# EAGLE design H2BR00 (EAGLE 9.6.2)

## Sheet 1 of 2
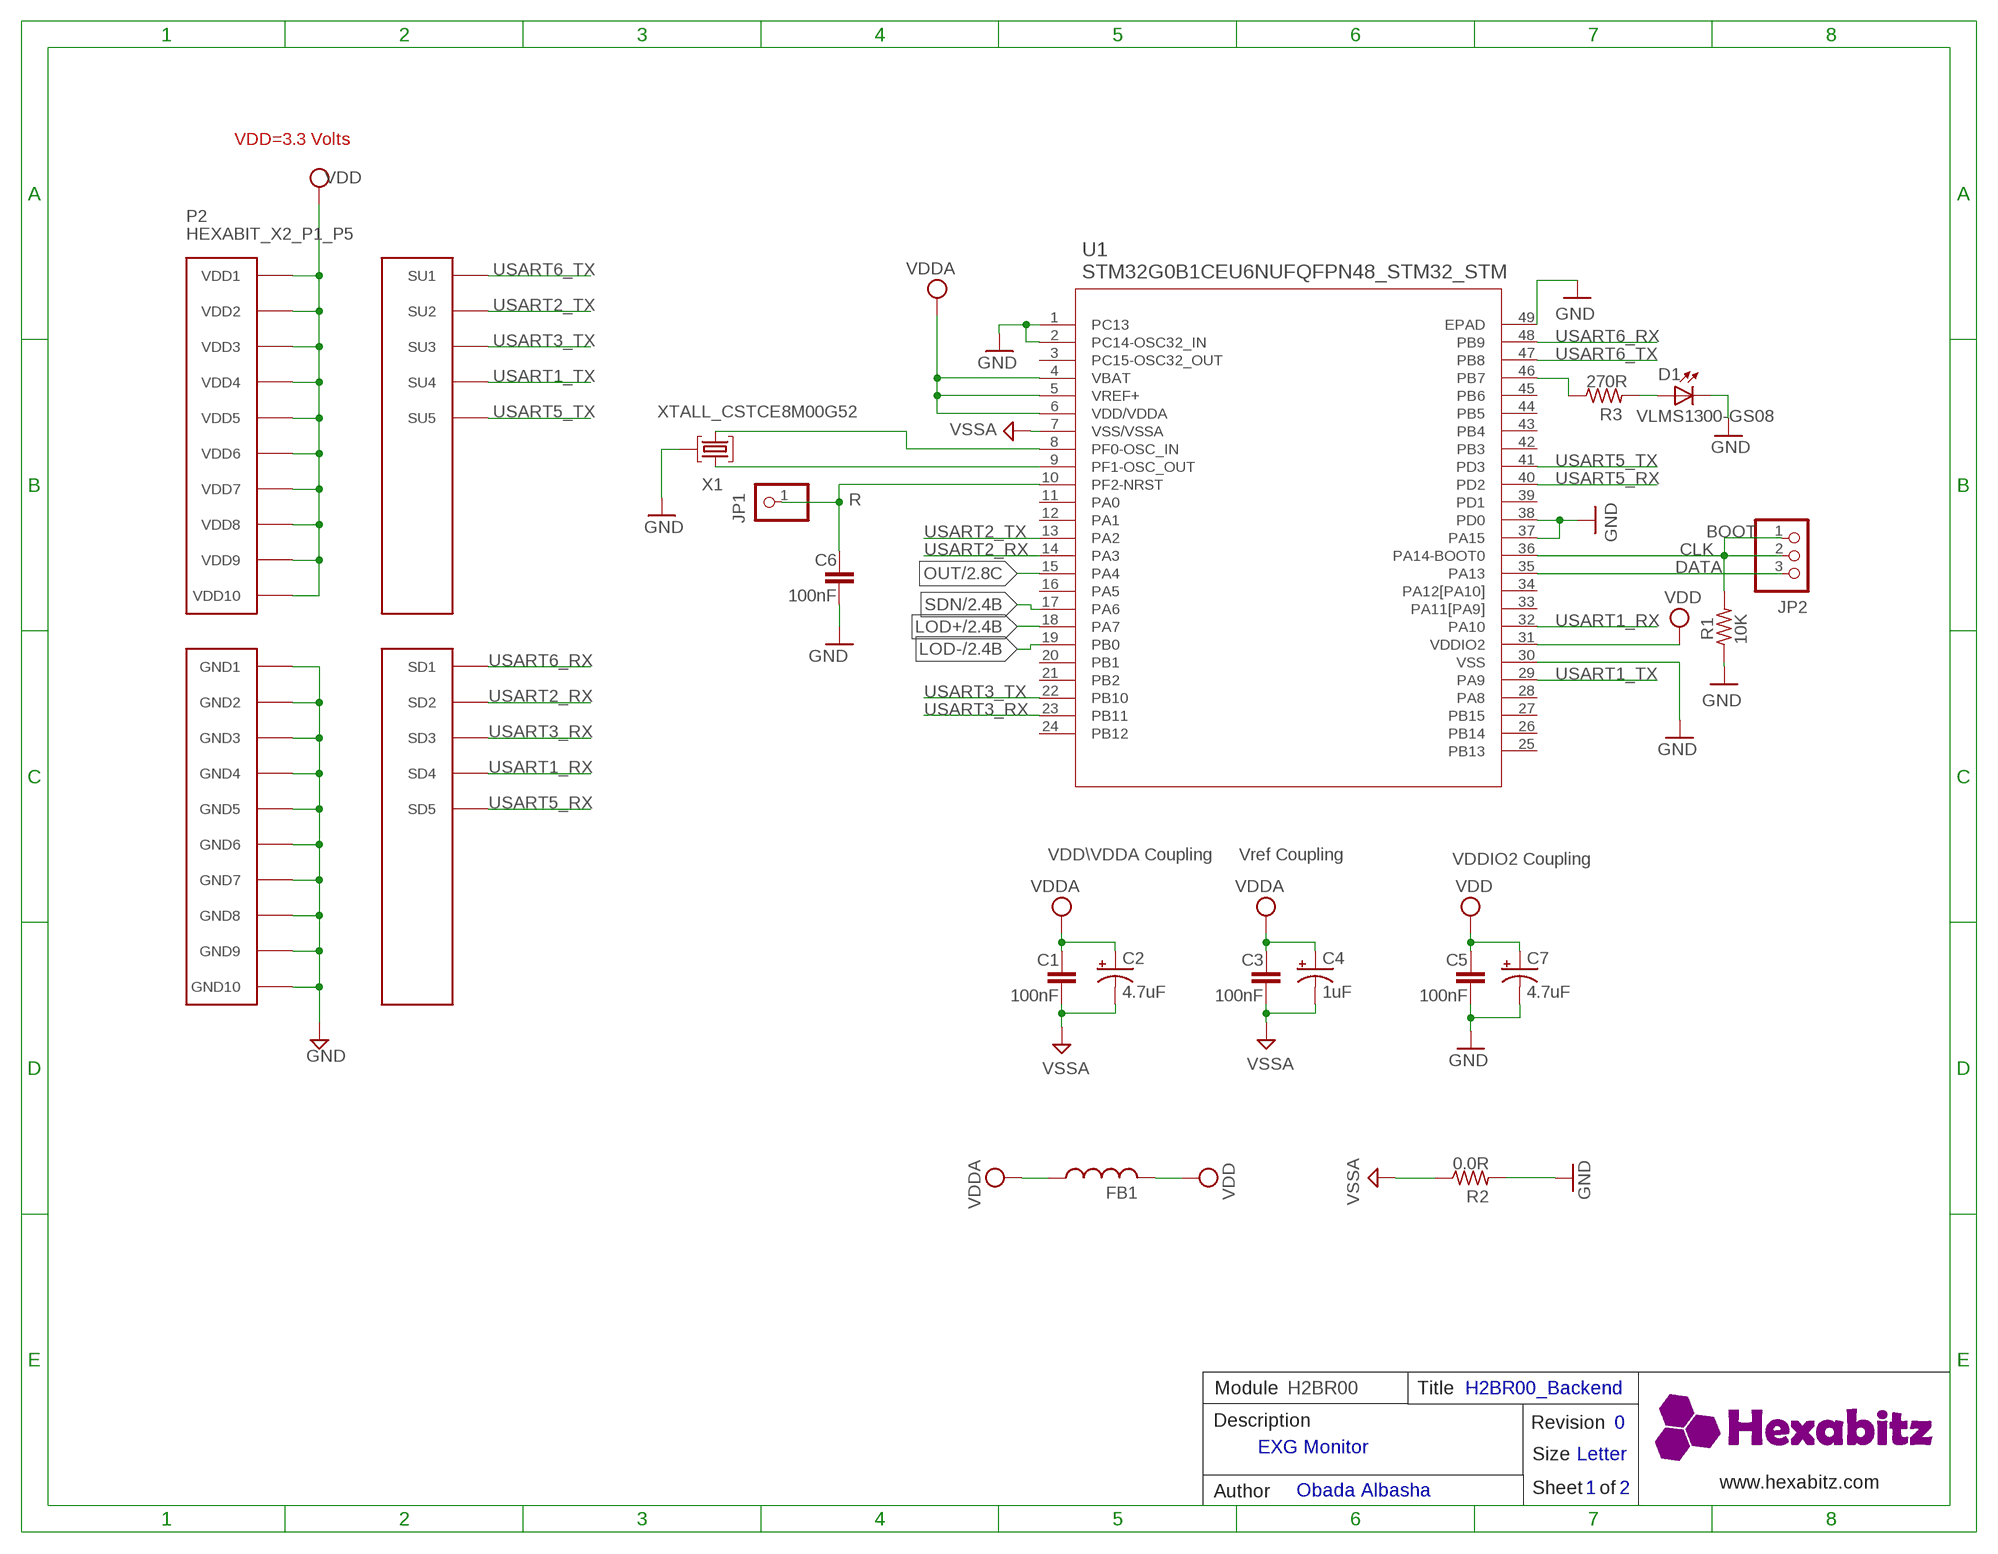
[diagram p0: schematic, sheet 1]

### Parts
C1  100nF  C-0603  [C-0603]
C2  4.7uF  C-0805-POL  [C-0805-POL]
C3  100nF  C-0603  [C-0603]
C4  1uF  C-0805-POL  [C-0805-POL]
C5  100nF  C-0603  [C-0603]
C6  100nF  C-0603  [C-0603]
C7  4.7uF  C-0805-POL  [C-0805-POL]
D1  VLMS1300-GS08  [VLMS1300-GS08]
FB1  FB-0603  [FB-0603]
JP1  R  PINHD-1X1  [1X01]
JP2  PINHD-1X3  [1X03]
P2  HEXABIT_X2_P1_P5  [HEXABIT_17.32_X2_P1_P5]
R1  10K  R-0603  [R-0603]
R2  0.0R  R-0603  [R-0603]
R3  270R  R-0603  [R-0603]
U1  STM32G0B1CEU6NUFQFPN48_STM32_STM  [UFQFPN48_STM32_STM]
X1  XTALL_CSTCE8M00G52  [XTALL_CSTCE8M00G52]

### Nets
CLK: JP2.1 JP2.2 R1.2 U1.36(PA14-BOOT0)
DATA: JP2.3 U1.35(PA13)
GND: C5.2 C6.2 C7.2(-) D1.C P2.PAD_PD11(GND1) P2.PAD_PD12(GND2) P2.PAD_PD13(GND3) P2.PAD_PD14(GND4) P2.PAD_PD15(GND5) P2.PAD_PD16(GND6) P2.PAD_PD17(GND7) P2.PAD_PD18(GND8) P2.PAD_PD19(GND9) P2.PAD_PD20(GND10) R1.1 R2.2 U1.1(PC13) U1.2(PC14-OSC32_IN) U1.30(VSS) U1.37(PA15) U1.38(PD0) U1.49(EPAD) X1.P$2 ; also sheet 2
LOD+: U1.18(PA7) ; also sheet 2
LOD-: U1.19(PB0) ; also sheet 2
N$1: D1.A R3.2
N$2: R3.1 U1.46(PB7)
N$5: U1.9(PF1-OSC_OUT) X1.P$1
N$6: U1.8(PF0-OSC_IN) X1.P$3
N$8: C6.1 JP1.1 U1.10(PF2-NRST)
OUT: U1.15(PA4) ; also sheet 2
SDN: U1.17(PA6) ; also sheet 2
USART1_RX: P2.PAD_PD4(SD4) U1.32(PA10)
USART1_TX: P2.PAD_PU4(SU4) U1.29(PA9)
USART2_RX: P2.PAD_PD2(SD2) U1.14(PA3)
USART2_TX: P2.PAD_PU2(SU2) U1.13(PA2)
USART3_RX: P2.PAD_PD3(SD3) U1.23(PB11)
USART3_TX: P2.PAD_PU3(SU3) U1.22(PB10)
USART5_RX: P2.PAD_PD5(SD5) U1.40(PD2)
USART5_TX: P2.PAD_PU5(SU5) U1.41(PD3)
USART6_RX: P2.PAD_PD1(SD1) U1.48(PB9)
USART6_TX: P2.PAD_PU1(SU1) U1.47(PB8)
VDD: C5.1 C7.1(+) FB1.2 P2.PAD_PU11(VDD1) P2.PAD_PU12(VDD2) P2.PAD_PU13(VDD3) P2.PAD_PU14(VDD4) P2.PAD_PU15(VDD5) P2.PAD_PU16(VDD6) P2.PAD_PU17(VDD7) P2.PAD_PU18(VDD8) P2.PAD_PU19(VDD9) P2.PAD_PU20(VDD10) U1.31(VDDIO2)
VDDA: C1.1 C2.1(+) C3.1 C4.1(+) FB1.1 U1.4(VBAT) U1.5(VREF+) U1.6(VDD/VDDA) ; also sheet 2
VSSA: C1.2 C2.2(-) C3.2 C4.2(-) R2.1 U1.7(VSS/VSSA)
Unconnected: U1.3(PC15-OSC32_OUT) U1.11(PA0) U1.12(PA1) U1.16(PA5) U1.20(PB1) U1.21(PB2) U1.24(PB12) U1.25(PB13) U1.26(PB14) U1.27(PB15) U1.28(PA8) U1.33(PA11[PA9]) U1.34(PA12[PA10]) U1.39(PD1) U1.42(PB3) U1.43(PB4) U1.44(PB5) U1.45(PB6)

### Notes on the sheet
- VDD=3.3 Volts
- BOOT
- VDD\VDDA Coupling | Vref Coupling | VDDIO2 Coupling
- Module | H2BR00 | Title | H2BR00_Backend
- Description | Revision | 0
- EXG Monitor
- Size | Letter
- www.hexabitz.com
- Author | Obada Albasha | Sheet   of | 1 | 2
- C:/Users/Admin/Desktop/logodraft.bmp

## Sheet 2 of 2
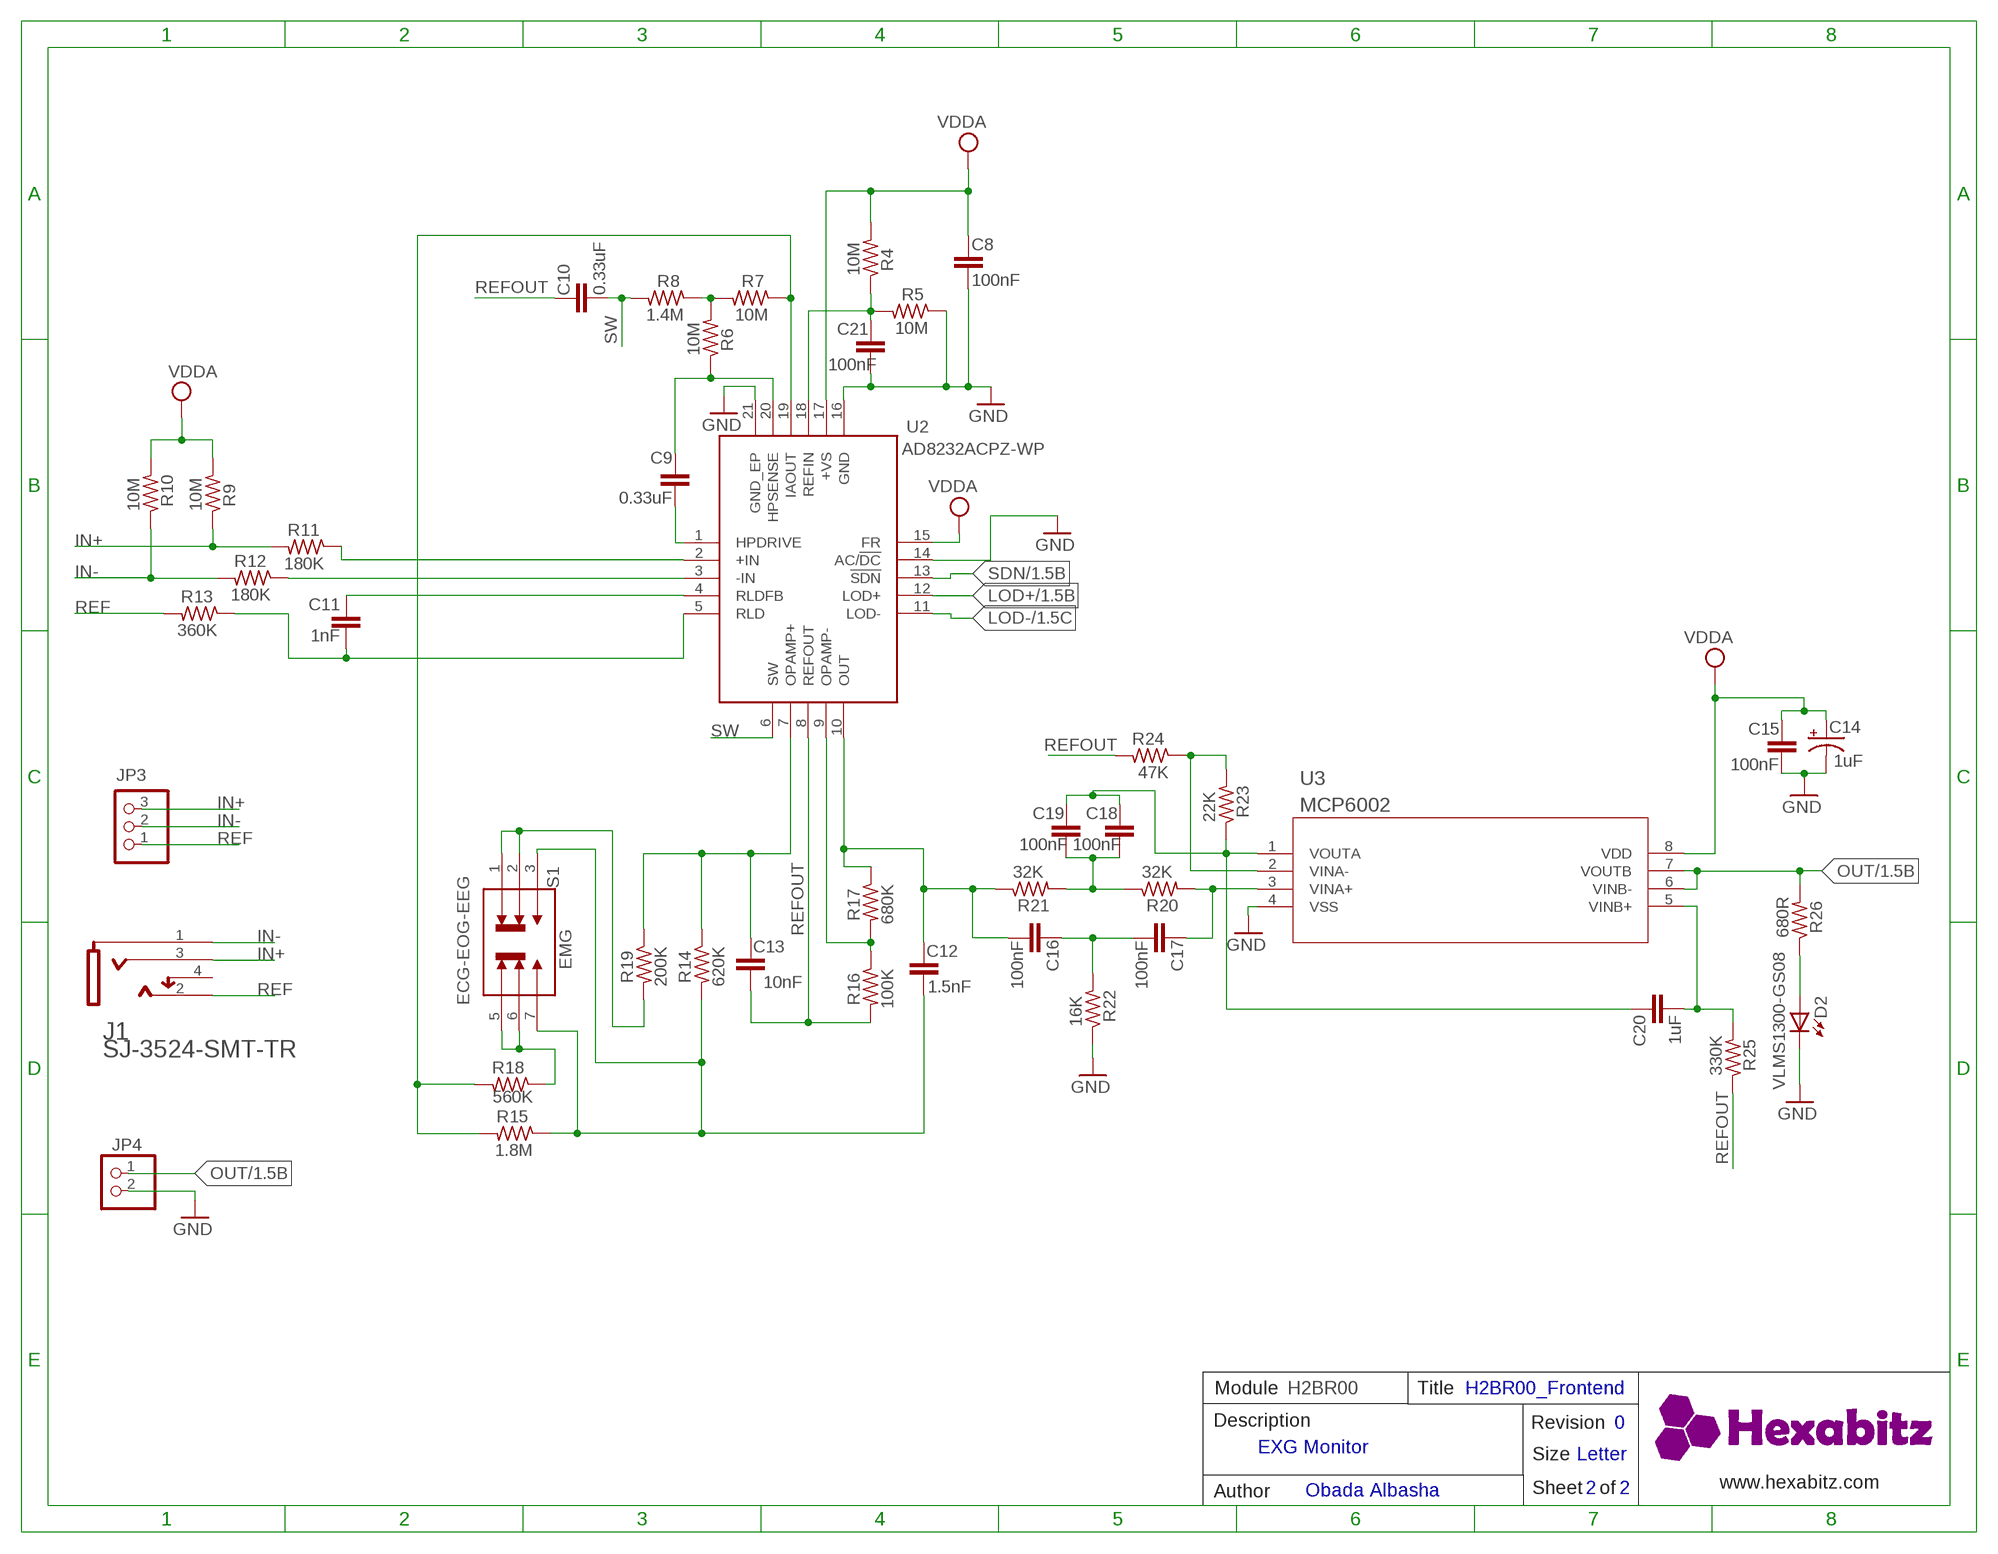
[diagram p1: schematic, sheet 2]

### Parts
C8  100nF  C-0603  [C-0603]
C9  0.33uF  C-0603  [C-0603]
C10  0.33uF  C-0603  [C-0603]
C11  1nF  C-0603  [C-0603]
C12  1.5nF  C-0603  [C-0603]
C13  10nF  C-0603  [C-0603]
C14  1uF  C-0805-POL  [C-0805-POL]
C15  100nF  C-0603  [C-0603]
C16  100nF  C-0603  [C-0603]
C17  100nF  C-0603  [C-0603]
C18  100nF  C-0603  [C-0603]
C19  100nF  C-0603  [C-0603]
C20  1uF  C-0603  [C-0603]
C21  100nF  C-0603  [C-0603]
D2  VLMS1300-GS08  [VLMS1300-GS08]
J1  CUI_DEVICES_SJ-3524-SMT-TRCUI_DEVICES_SJ-3524-SMT-TR_0_0  [CUI_DEVICES_SJ-3524-SMT-TR_0]
JP3  PINHD-1X3  [1X03]
JP4  PINHD-1X2(ROUND)  [1X02]
R4  10M  R-0603  [R-0603]
R5  10M  R-0603  [R-0603]
R6  10M  R-0603  [R-0603]
R7  10M  R-0603  [R-0603]
R8  1.4M  R-0603  [R-0603]
R9  10M  R-0603  [R-0603]
R10  10M  R-0603  [R-0603]
R11  180K  R-0603  [R-0603]
R12  180K  R-0603  [R-0603]
R13  360K  R-0603  [R-0603]
R14  620K  R-0603  [R-0603]
R15  1.8M  R-0603  [R-0603]
R16  100K  R-0603  [R-0603]
R17  680K  R-0603  [R-0603]
R18  560K  R-0603  [R-0603]
R19  200K  R-0603  [R-0603]
R20  32K  R-0603  [R-0603]
R21  32K  R-0603  [R-0603]
R22  16K  R-0603  [R-0603]
R23  22K  R-0603  [R-0603]
R24  47K  R-0603  [R-0603]
R25  330K  R-0603  [R-0603]
R26  680R  R-0603  [R-0603]
S1  JS202011JCQN  [SW_JS202011JCQN]
U2  AD8232ACPZ-WP  [QFN50P400X400X80-21N]
U3  MCP6002  MCP6002-I/SNSOIC8-N_MC_MCH-L  [SOIC8-N_MC_MCH-L]

### Nets
GND: C8.2 C14.2(-) C15.2 C21.2 D2.C JP4.2 R5.1 R22.1 U2.14(AC/!DC) U2.16(GND) U2.21(GND_EP) U3.4(VSS) ; also sheet 1
IN+: J1.3(RING) JP3.3 R9.1 R11.2
IN-: J1.1(SLEEVE) JP3.2 R10.1 R12.2
LOD+: U2.12(LOD+) ; also sheet 1
LOD-: U2.11(LOD-) ; also sheet 1
N$3: C21.1 R4.1 R5.2 U2.18(REFIN)
N$4: C9.2 U2.1(HPDRIVE)
N$7: C9.1 R6.1 U2.20(HPSENSE)
N$9: R7.1 R15.2 R18.2 U2.19(IAOUT)
N$10: R6.2 R7.2 R8.1
N$11: R16.1 R17.2 U2.9(OPAMP-)
N$12: C12.1 C16.2 R17.1 R21.1 U2.10(OUT)
N$13: C11.1 U2.4(RLDFB)
N$14: R11.1 U2.2(+IN)
N$15: R12.1 U2.3(-IN)
N$16: C12.2 R14.2 R15.1 S1.3 S1.7
N$17: C11.2 R13.1 U2.5(RLD)
N$18: C13.1 R14.1 R19.1 U2.7(OPAMP+)
N$19: R18.1 S1.5 S1.6
N$20: R19.2 S1.1 S1.2
N$22: C17.1 R20.2 U3.3(VINA+)
N$23: D2.A R26.1
N$24: C16.1 C17.2 R22.2
N$25: C20.2 R25.2 U3.5(VINB+)
N$26: C18.1 C19.1 C20.1 R23.1 U3.1(VOUTA)
N$27: R23.2 R24.1 U3.2(VINA-)
N$28: C18.2 C19.2 R20.1 R21.2
OUT: JP4.1 R26.2 U3.6(VINB-) U3.7(VOUTB) ; also sheet 1
REF: J1.2(TIP) JP3.1 R13.2
REFOUT: C10.1 C13.2 R16.2 R24.2 R25.1 U2.8(REFOUT)
SDN: U2.13(!SDN) ; also sheet 1
SW: C10.2 R8.2 U2.6(SW)
VDDA: C8.1 C14.1(+) C15.1 R4.2 R9.2 R10.2 U2.15(FR) U2.17(+VS) U3.8(VDD) ; also sheet 1
Unconnected: J1.4(TIP_SWITCH)

### Notes on the sheet
- ECG-EOG-EEG
- EMG
- Module | H2BR00 | Title | H2BR00_Frontend
- Description | Revision | 0
- EXG Monitor
- Size | Letter
- www.hexabitz.com
- Author | Obada Albasha | Sheet   of | 2 | 2
- C:/Users/Admin/Desktop/logodraft.bmp

## Library data of the parts
C1 C3 C5 C6 C8-C13 C15-C21 = HEXABITZ_RCLS:C-0603: CAP CER 10% X7R 0603
C2 C4 C7 C14 = HEXABITZ_RCLS:C-0805-POL: Cap Tant Solid SMD 2012
D1 D2 = Hexabitz:VLMS1300-GS08: Red 0603 130° Clear 54 mcd 2 V Surface Mount ChipLED ; Octopart Url : http://octopart.com/vlms1300-gs08-vishay-21709201; MFN: Vishay; MPN: VLMS1300-GS08; OCTOPART_URL: https://octopart.com/vlms1300-gs08-vishay-21709201?r=sp&s=_gcP4_q8T1SC6PJQPTQ9yA
FB1 = HEXABITZ_RCLS:FB-0603: Ferrite Beads Multi-Layer 0603
J1 = HEXABITZ_ICs:CUI_DEVICES_SJ-3524-SMT-TR: 3.50mm (0.141", 1/8", Mini Plug) - Headphone Phone Jack Stereo (3 Conductor, TRS) Connector Solder; AUTOMOTIVE: No; CENTROID_NOT_SPECIFIED: No; CONN_ORIENTATION: Horizontal; CONTACT_MATERIAL: Silver; CURRENT_RATING: 1A; DATASHEET: https://www.cuidevices.com/product/resource/sj-352x-smt.pdf; DEVICE_CLASS_L1: Connectors; DEVICE_CLASS_L2: Audio / Video Connectors; DEVICE_CLASS_L3: unset; DIGIKEY_DESCRIPTION: CONN JACK STEREO 3.5MM SMD R/A; DIGIKEY_PART_NUMBER: CP-3524SJCT-ND; FOOTPRINT_VARIANT_NAME_0: Recommended_Land_Pattern; HEIGHT: 5.37mm; LEAD_FREE: Yes; MFG_PACKAGE_IDENT: 0; MFG_PACKAGE_IDENT_DATE: 0; MFG_PACKAGE_IDENT_REV: 0; MFN: CUI Devices; MOUSER_PART_NUMBER: 490-SJ-3524-SMT-TR; MPN: SJ-3524-SMT-TR; NUMBER_OF_CONTACTS: 4; OCTOPART_URL: https://octopart.com/sj-3524-smt-tr-cui+devices-106234236?r=sp; PACKAGE: SMT_JACK_17MM0_6MM0; PREFIX: J; ROHS: Yes; STANDOFF_HEIGHT: 0.03mm; TEMPERATURE_RANGE_HIGH: +85°C; TEMPERATURE_RANGE_LOW: -25°C; VERIFICATION_VERSION: 0.0.0.3; VOLTAGE_RATING: 12V
JP1 = HEXABITZ_USER_INTERFACE_PARTS:PINHD-1X1: PIN HEADER; MFN: TE Connectivity; MPN: 87227-1; OCTOPART_URL: https://octopart.com/87227-1-te+connectivity-39512052?r=sp
JP2 JP3 = pinhead:PINHD-1X3: PIN HEADER
JP4 = pinhead:PINHD-1X2(ROUND): PIN HEADER
P2 = hexabitz_connectors:HEXABIT_X2_P1_P5
R1-R26 = HEXABITZ_RCLS:R-0603: Thick Film Resistors - SMD 0603
S1 = HEXABITZ_OTHER_PARTS:JS202011JCQN: Slide Switch DPDT Surface Mount; DESCRIPTION: Slide Switch DPDT Surface Mount; DIGI-KEY_PART_NUMBER: CKN10723TR-ND; MF: C&K; MP: JS202011JCQN; PACKAGE: DPDT-6 C&amp;K; PURCHASE-URL: https://pricing.snapeda.com/search/part/JS202011JCQN/?ref=eda
U1 = HEXABITZ_ICs:STM32G0B1CEU6N; COPYRIGHT: Copyright (C) 2022 Ultra Librarian. All rights reserved.; MFN: STMicroelectronics; MPN: STM32G0B1CEU6N; OCTOPART_URL: https://app.ultralibrarian.com/details/c038d58b-752a-11eb-9033-0a34d6323d74/STMicroelectronics/STM32G0B1CEU6N?uid=116364672
U2 = HEXABITZ_ICs:AD8232ACPZ-WP: Heart Rate Monitor Front End LFCSP20EP AD8232ACPZ-WP, Analogue Front End IC, 1-channel, 20-Pin LFCSP Source: Datasheet <https://datasheet.datasheetarchive.com/originals/distributors/Datasheets-SFU1/DSASFU10003822.pdf>; DESCRIPTION: Heart Rate Monitor Front End LFCSP20EP AD8232ACPZ-WP, Analogue Front End IC, 1-channel, 20-Pin LFCSP; HEIGHT: 0.8mm; MANUFACTURER_NAME: Analog Devices; MANUFACTURER_PART_NUMBER: AD8232ACPZ-WP; MOUSER_PART_NUMBER: 584-AD8232ACPZ-WP; MOUSER_PRICE-STOCK: https://www.mouser.co.uk/ProductDetail/Analog-Devices/AD8232ACPZ-WP?qs=%2FtpEQrCGXCzCRiJ%252BumD7TQ%3D%3D
U3 = HEXABITZ_ICs:MCP6002-I/SN; COPYRIGHT: Copyright (C) 2022 Ultra Librarian. All rights reserved.; DIGI-KEY_PART_NUMBER_1: MCP6002-I/SN-CRL-ND; DIGI-KEY_PART_NUMBER_2: MCP6002-I/SN-ND; MANUFACTURER_PART_NUMBER: MCP6002-I/SN; MFR_NAME: Microchip
X1 = Hexabitz:XTALL_CSTCE8M00G52: MURATA CSTCE8M00G52-R0 RESONATOR, SMD, 8MHZ ; Octopart Url : https://octopart.com/cstce8m00g52-r0-murata-7145559; MFN: Murata; MPN: CSTCE8M00G52Z-R0; OCTOPART_URL: https://octopart.com/cstce8m00g52z-r0-murata-17755941?r=sp&s=JDnNJnrHQhyS8Zk4ofFWXw

## Board
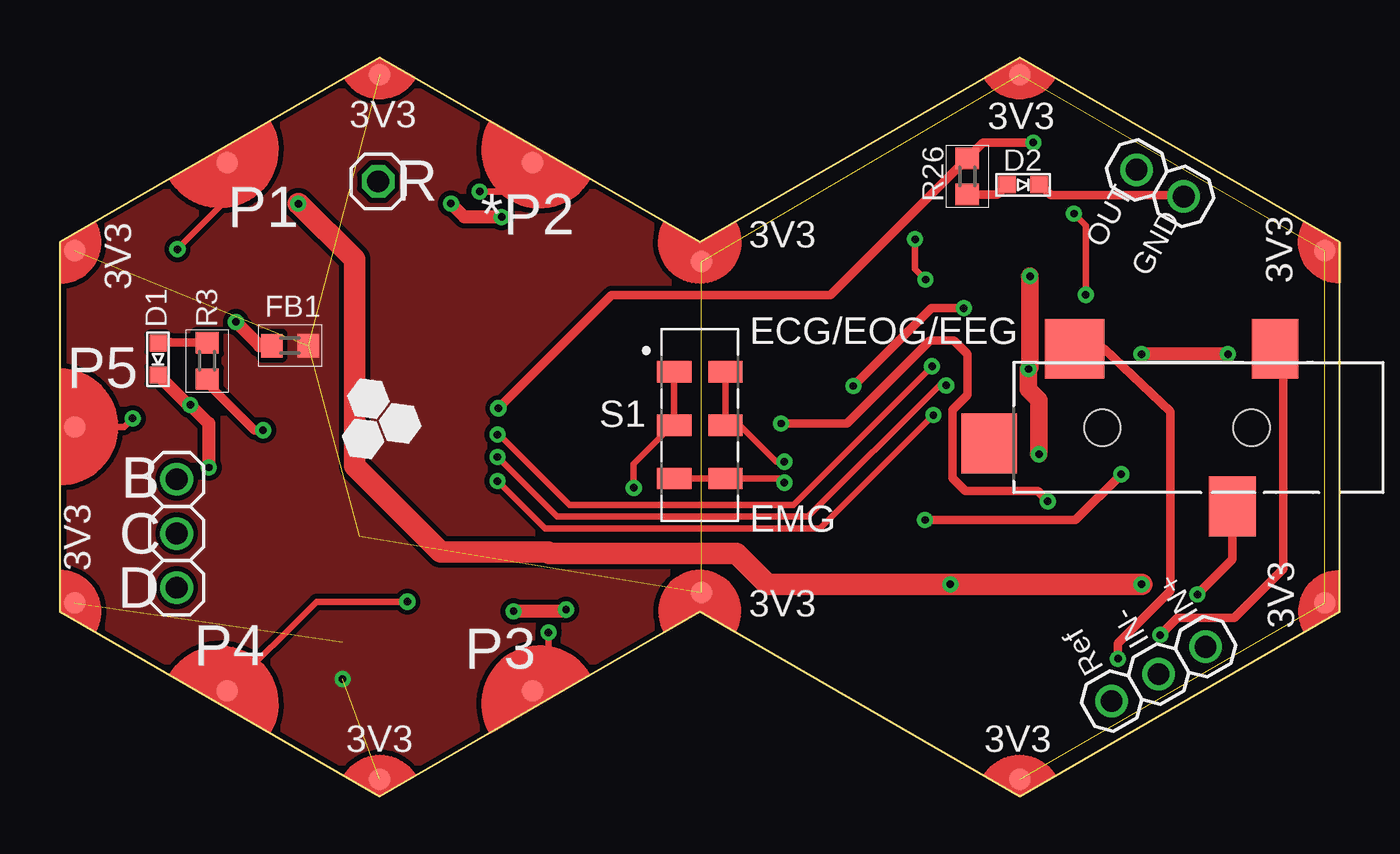
[diagram p2: board, top side]
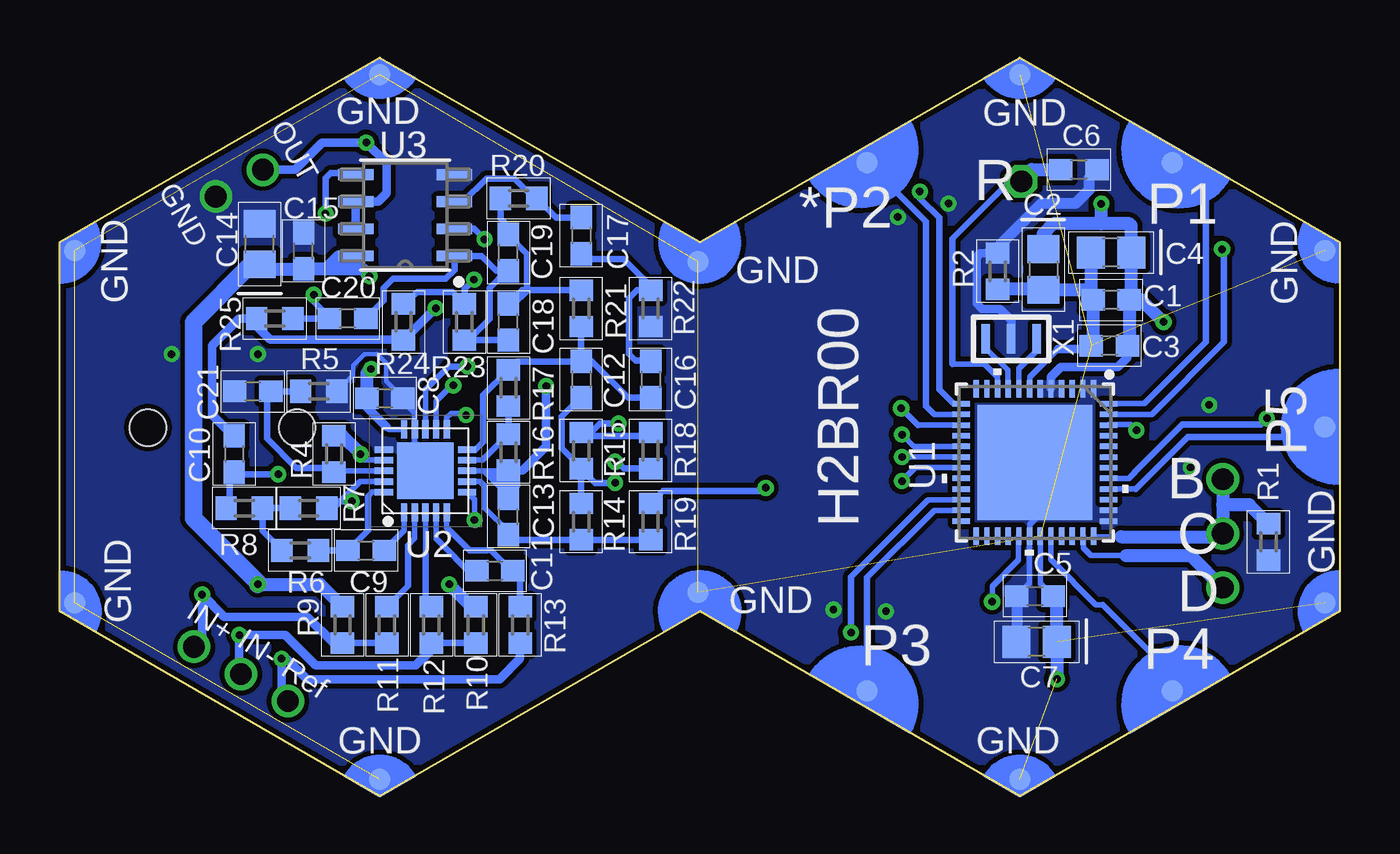
[diagram p3: board, bottom side, seen from below]

Size 60 x 34.64 mm. Coordinates in mm from the lower left corner, seen from the top.
Copper layers (1*16): Top 0.035mm / dielectric 1.5mm / Bottom 0.035mm
Design rules "default *": minimum track width 6mil, minimum drill 0.35mm, track to track 9mil, track to pad 9mil, pad to pad 9mil, via to via 9mil, smd to smd 9mil, copper to edge 10mil, drill to drill 6mil, minimum pad ring 10mil, minimum via ring 8mil, stop-mask expansion 4mil, vias tented up to drill 24mil, thermal gap 10mil

### Footprints (pad centres in the part's own frame; a part is rotated, then mirrored left to right if it is on the bottom)
C-0603 = smd 1.1 x 1: 1 -0.85,0; 2 0.85,0
C-0805-POL = smd 1.3 x 1.5: 1 -0.95,0; 2 0.95,0
VLMS1300-GS08 = smd 0.8 x 0.8: A 0,0.75; C 0,-0.75
FB-0603 = smd 1 x 1.1: 1 -0.85,0; 2 0.85,0
CUI_DEVICES_SJ-3524-SMT-TR_0 = smd 2.2 x 2.8: 1 -3.6,-3.7; 3 -1.6,3.7 | smd 2.8 x 2.8: 2 5.8,-3.7 | smd 2.6 x 2.8: 4 9.8,0.75 | hole 1.7: -2.5,0; 4.5,0
1X01 = drill 1.016 octagon: 1 0,0
1X03 = drill 1.016: 1 -2.54,0; 2 0,0; 3 2.54,0
1X02 = drill 1.016: 1 -1.27,0; 2 1.27,0
HEXABIT_17.32_X2_P1_P5 = smd 1 x 1 bottom: PAD_PD1 12.39,22.39; PAD_PD2 12.39,8.09; PAD_PD3 -12.39,8.09; PAD_PD4 -12.39,22.39; PAD_PD5 0,29.55; PAD_PD12 16.52,15.24; PAD_PD13 7.752,0.168; PAD_PD14 16.52,-14.76; PAD_PD15 8.26,-29.07; PAD_PD16 -8.26,-29.07; PAD_PD17 -16.52,-14.76; PAD_PD18 -7.752,0.168; PAD_PD19 -16.52,15.24 | smd 1 x 1 rotated 60 bottom: PAD_PD11 8.26,29.547 | smd 1 x 1 rotated 120 bottom: PAD_PD20 -8.26,29.547 | smd 1 x 1: PAD_PU1 12.39,22.39; PAD_PU2 12.39,8.09; PAD_PU3 -12.39,8.09; PAD_PU4 -12.39,22.39; PAD_PU5 0,29.55; PAD_PU12 16.52,15.24; PAD_PU13 7.752,0.168; PAD_PU14 16.52,-14.76; PAD_PU15 8.26,-29.07; PAD_PU16 -8.26,-29.07; PAD_PU17 -16.52,-14.76; PAD_PU18 -7.752,0.168; PAD_PU19 -16.52,15.24 | smd 1 x 1 rotated 60: PAD_PU11 8.26,29.547 | smd 1 x 1 rotated 120: PAD_PU20 -8.26,29.547
R-0603 = smd 1 x 1.1: 1 -0.85,0; 2 0.85,0
SW_JS202011JCQN = smd 1.6 x 1: 1 -1.2,2.5; 2 -1.2,0; 3 -1.2,-2.5; 5 1.2,2.5; 6 1.2,0; 7 1.2,-2.5
UFQFPN48_STM32_STM = smd 0.813 x 0.254: 1 -3.454,2.751; 2 -3.454,2.251; 3 -3.454,1.75; 4 -3.454,1.25; 5 -3.454,0.75; 6 -3.454,0.25; 7 -3.454,-0.25; 8 -3.454,-0.75; 9 -3.454,-1.25; 10 -3.454,-1.75; 11 -3.454,-2.251; 12 -3.454,-2.751; 25 3.454,-2.751; 26 3.454,-2.251; 27 3.454,-1.75; 28 3.454,-1.25; 29 3.454,-0.75; 30 3.454,-0.25; 31 3.454,0.25; 32 3.454,0.75; 33 3.454,1.25; 34 3.454,1.75; 35 3.454,2.251; 36 3.454,2.751 | smd 0.254 x 0.813: 13 -2.751,-3.454; 14 -2.251,-3.454; 15 -1.75,-3.454; 16 -1.25,-3.454; 17 -0.75,-3.454; 18 -0.25,-3.454; 19 0.25,-3.454; 20 0.75,-3.454; 21 1.25,-3.454; 22 1.75,-3.454; 23 2.251,-3.454; 24 2.751,-3.454; 37 2.751,3.454; 38 2.251,3.454; 39 1.75,3.454; 40 1.25,3.454; 41 0.75,3.454; 42 0.25,3.454; 43 -0.25,3.454; 44 -0.75,3.454; 45 -1.25,3.454; 46 -1.75,3.454; 47 -2.251,3.454; 48 -2.751,3.454 | smd 5.385 x 5.385: 49 0,0
QFN50P400X400X80-21N = smd 0.85 x 0.3: 1 -1.95,1; 2 -1.95,0.5; 3 -1.95,0; 4 -1.95,-0.5; 5 -1.95,-1; 11 1.95,-1; 12 1.95,-0.5; 13 1.95,0; 14 1.95,0.5; 15 1.95,1 | smd 0.3 x 0.85: 6 -1,-1.95; 7 -0.5,-1.95; 8 0,-1.95; 9 0.5,-1.95; 10 1,-1.95; 16 1,1.95; 17 0.5,1.95; 18 0,1.95; 19 -0.5,1.95; 20 -1,1.95 | smd 2.65 x 2.65: 21 0,0
SOIC8-N_MC_MCH-L = smd 1.676 x 0.508: 1 -2.311,1.905; 2 -2.311,0.635; 3 -2.311,-0.635; 4 -2.311,-1.905; 5 2.311,-1.905; 6 2.311,-0.635; 7 2.311,0.635; 8 2.311,1.905
XTALL_CSTCE8M00G52 = smd 1.4 x 0.4: P$1 0,1.2; P$2 0,0; P$3 0,-1.2

### Placement (x,y rotation side)
C1  10.71,23.27 180 bottom
C2  13.89,24.7 270 bottom
C3  10.79,21.13 180 bottom
C4  10.71,25.5 180 bottom
C5  14.29,9.38 180 bottom
C6  12.22,29.38 0 bottom
C7  14.21,7.24 180 bottom
C8  44.77,18.67 0 bottom
C9  45.64,11.53 0 bottom
C10  51.83,16.05 270 bottom
C11  39.61,10.57 0 bottom
C12  35.56,19.54 270 bottom
C13  38.97,13.11 90 bottom
C14  50.64,25.89 90 bottom
C15  48.58,25.57 90 bottom
C16  32.3,19.54 270 bottom
C17  35.56,26.29 270 bottom
C18  38.97,22.24 90 bottom
C19  38.97,25.5 90 bottom
C20  46.51,22.4 180 bottom
C21  50.96,18.99 180 bottom
D1  4.6,20.5 0 top
D2  45.16,28.67 90 top
FB1  10.79,21.13 0 top
J1  53.38,17.29 180 top
JP1  14.92,28.83 0 top
JP2  5.47,12.32 270 top
JP3  51.51,5.73 30.1 top
JP4  51.59,28.75 330.2 top
P2  30.24,17.32 90 top
R1  3.33,11.92 90 bottom
R2  16.03,24.62 90 bottom
R3  6.9,20.42 90 top
R4  47.15,16.05 90 bottom
R5  47.86,18.99 180 bottom
R6  48.73,11.53 180 bottom
R7  48.34,13.51 180 bottom
R8  51.35,13.51 180 bottom
R9  46.75,8.03 90 bottom
R10  40.5,8.03 90 bottom
R11  44.67,8.03 270 bottom
R12  42.58,8.03 270 bottom
R13  38.42,8.03 270 bottom
R14  35.56,12.88 90 bottom
R15  35.56,16.21 90 bottom
R16  38.97,16.13 270 bottom
R17  38.97,19.15 270 bottom
R18  32.3,16.21 90 bottom
R19  32.3,12.88 90 bottom
R20  38.49,28.04 0 bottom
R21  35.56,22.88 90 bottom
R22  32.3,22.88 90 bottom
R23  41.03,22.24 90 bottom
R24  43.89,22.24 270 bottom
R25  49.92,22.4 0 bottom
R26  42.54,29.07 90 top
S1  30,17.4 0 top
U1  14.29,15.65 270 bottom
U2  42.86,15.26 90 bottom
U3  43.81,27.24 180 bottom
X1  15.4,21.45 90 bottom

### Tracks (layer width: path | path; a pad name or v marks a point on that pad's centre or on a via)
CLK
  Bottom 0.254: U1.36 11.5,12.16 10.24,12.16
  Bottom 0.61: 10.24,12.16 5.63,12.16 JP2.2 5.47,13.67 | JP2.1 5.47,13.67 | R1.2 4.23,13.67 5.47,13.67
DATA
  Bottom 0.254: U1.35 12.02,12.18 12.02,11.64 11.66,11.29 10,11.29
  Bottom 0.61: 10,11.29 6.98,11.29 JP2.3
GND  (via drill 0.35)
  Top 0.406: v6.11,18.35 6.03,18.32 | D2.C 45.97,28.67 46.47,28.18 52.63,28.18 JP4.2
  Top 0.61: D1.C 6.03,18.32 | v20.71,27.16 18.97,27.16 v18.33,27.8 | v6.11,18.35 6.98,17.48 v6.98,15.41 | v23.73,8.75 23.65,8.67 v21.27,8.67 | v54.77,20.73 v50.72,20.73
  Bottom 0.203: C8.2 44.71,19.46 44.71,20.32 45.12,20.74 45.71,20.74 46.25,20.2 46.25,19.75 R5.1
  Bottom 0.254: C5.2 14.54,9.98 U1.30 14.52,12.22 14.52,12.75 14.29,12.98 U1.49 | C8.2 43.92,18.53 43.36,17.98 U2.14 43.36,16.26 43.42,16.21 43.42,15.81 U2.21
  Bottom 0.406: X1.P$2 15.4,22.32 15.92,22.84 16.76,22.84 17.01,23.09 17.01,25.31 16.85,25.47 16.3,25.47 | 16.11,25.47 R2.2
  Bottom 0.508: C5.2 15.14,7.26 C7.2 | 16.3,25.47 13.98,27.8 12.38,27.8 11.75,28.43 11.75,29.01 C6.2
  pour Bottom (no thermals): 29.84,26.13 15,34.62 0.08,26.05 0,8.75 14.92,0.02 29.92,8.59 44.92,0.02 60.01,8.59 60.01,25.89 45.08,34.62 29.92,25.97 29.68,26.21
IN+  (via drill 0.35)
  Top 0.406: J1.3 54.98,11.1 v53.34,9.46
  Bottom 0.305: R11.2 R9.1 47.17,7.18
  Bottom 0.406: 47.17,7.18 48.41,8.42 52.29,8.42 v53.34,9.46 53.34,7.37 JP3.3
IN-  (via drill 0.35)
  Top 0.406: J1.1 57.37,20.59 57.37,10.67 55.05,8.35 52.39,8.35 v51.59,7.56
  Bottom 0.305: R10.1 R12.2
  Bottom 0.406: JP3.2 51.59,5.81 v51.59,7.56 49.45,7.56 48.02,6.13 43.32,6.13 42.58,6.87 R12.2
LOD+  (via drill 0.35)
  Top 0.305: v41.55,19.27 41.23,19.27 35.08,13.11 23.31,13.11 v20.52,15.91
  Bottom 0.254: U2.12 42.36,18.53 41.63,19.27 | v20.52,15.91 v20.51,15.9 U1.18
  Bottom 0.305: 41.63,19.27 v41.55,19.27
LOD-  (via drill 0.35)
  Top 0.305: v40.96,17.88 35.64,12.56 22.74,12.56 v20.52,14.78
  Bottom 0.254: v20.52,14.78 19.88,15.41 17.75,15.41 U1.19 | U2.11 41.86,17.76 41.67,17.95 41.04,17.95 v40.96,17.88
N$1
  Top 0.406: R3.2 5.19,21.27 5.18,21.3 5.19,21.29 D1.A
N$2  (via drill 0.35)
  Top 0.406: R3.1 6.9,19.38 9.13,17.16 v9.52,17.16
  Bottom 0.254: v9.52,17.16 9.78,17.42 10.81,17.42 U1.46
N$3
  Bottom 0.254: U2.18 46.72,15.26 47.25,15.35 | R4.1 47.09,15.19
  Bottom 0.305: R5.2 C21.1 50.29,18.8 50.29,16.77 48.92,15.4 47.3,15.4 47.25,15.35 47.09,15.19
N$4
  Bottom 0.254: U2.1 43.86,12.45 C9.2
N$5
  Bottom 0.254: U1.9 15.55,19.12 15.55,19.98 16.6,21.02 X1.P$1
N$6
  Bottom 0.254: X1.P$3 14.2,20.89 15.04,20.05 U1.8
N$7
  Bottom 0.254: U2.20 45.37,14.26 45.56,14.07
  Bottom 0.305: 45.56,14.07 45.56,12.46 C9.1 R6.1
N$8
  Bottom 0.254: U1.10 16.05,19.12 16.05,19.66 16.65,20.26 18.15,20.26
  Bottom 0.305: 18.15,20.26 18.15,26.15 15.48,28.83 15,28.83 JP1.1
  Bottom 0.508: 15,28.83 14.44,29.38
  Bottom 0.61: 14.44,29.38 C6.1
N$9  (via drill 0.35)
  Top 0.406: v33.81,17.48 36.91,17.48 40.8,21.37 41.91,21.37 42.54,20.73 42.54,18.82 41.84,18.12 41.84,14.92 42.46,14.3 45.84,14.3 v46.32,13.83
  Bottom 0.254: U2.19 45.92,14.76 47.17,13.51 R7.1
  Bottom 0.305: R18.2 32.46,16.9 35.4,16.9 R15.2 35.11,17.06 34.69,17.48 v33.81,17.48 | R7.1 47.17,13.83 v46.32,13.83
N$10
  Bottom 0.305: R6.2 50.5,12.45 R8.1 R7.2
N$11
  Bottom 0.254: U2.9 40.19,15.76 39.99,15.96
  Bottom 0.305: R17.2 R16.1 39.99,15.96
N$12
  Bottom 0.254: U2.10 40.51,16.26
  Bottom 0.305: 40.51,16.26 40.16,16.61 40.16,18.8 R17.1 38.57,20.39 C12.1 | C16.2 33.36,18.69 35.06,20.39 C12.1 | R21.1 C12.1
N$13
  Bottom 0.254: U2.4 42.36,12.08 42.06,11.78
  Bottom 0.305: 42.06,11.78 40.85,10.57 C11.1
N$14
  Bottom 0.254: U2.2 43.36,12.08 43.68,11.76
  Bottom 0.305: 43.68,11.76 43.68,9.87 R11.1
N$15
  Bottom 0.254: U2.3 42.86,11.37
  Bottom 0.305: R12.1 42.86,9.16 42.86,11.37
N$16  (via drill 0.35)
  Top 0.305: v33.97,14.7 33.77,14.9 S1.7 S1.3
  Bottom 0.305: R14.2 R15.1 | C12.2 35.59,18.69 36.49,17.8 36.49,16.32 35.56,15.39 R15.1 | v33.97,14.7 34.9,14.7 R15.1
N$17
  Bottom 0.254: U2.5 41.86,12.59 41.75,12.48 | 40,11.53 39.79,11.53 38.83,10.57
  Bottom 0.305: 41.75,12.48 40.8,11.53 40,11.53 | 38.83,10.57 C11.2 38.42,10.23 R13.1
N$18
  Bottom 0.254: U2.7 40.3,14.76 40.06,14.52 40.06,13.5 38.97,12.41 C13.1
  Bottom 0.305: C13.1 38.73,12.03 R14.1 R19.1
N$19  (via drill 0.35)
  Top 0.305: S1.5 S1.6 31.86,17.4 33.57,15.69 v33.97,15.69
  Bottom 0.305: v33.97,15.69 33.88,15.69 33.56,15.36 R18.1
N$20  (via drill 0.35)
  Top 0.305: S1.1 S1.2 28.72,17.4 26.91,15.58 v26.91,14.46
  Bottom 0.305: v26.91,14.46 27.07,14.3 31.73,14.3 R19.2
N$22
  Bottom 0.305: C17.1 36.75,27.14 R20.2 37.76,28.04 38.69,28.97 40,28.97 41.09,27.88 U3.3
N$23
  Top 0.406: D2.A 43.96,28.22 R26.1
N$24
  Bottom 0.305: C16.1 32.34,20.43 33.01,20.43 33.31,20.73 33.31,23.35 32.94,23.73 R22.2 32.36,23.78 32.36,23.96 33.57,25.18 35.3,25.18 C17.2
N$25  (via drill 0.35)
  Top 0.305: v47.54,27.32 48.1,26.77 v48.1,23.51
  Bottom 0.305: R25.2 C20.2 47.36,22.46 48.1,23.19 v48.1,23.51 | v47.54,27.32 47.54,28.99 47.31,29.23 46.2,29.23 U3.5
N$26
  Bottom 0.305: C20.1 44.82,23.24 44.82,23.82 44.37,24.27 41.91,24.27 41.5,24.68 U3.1 40.24,25.34 39.55,24.65 C19.1 39.05,24.65 39.87,23.83 39.87,22.36 40.84,21.39 R23.1 C18.1
N$27  (via drill 0.35)
  Top 0.305: v40.09,26.12 v40.08,26.11 40.08,24.73 v40.58,24.23
  Bottom 0.305: R24.1 43.81,23.09 43.26,23.65 41.59,23.65 R23.2 41.04,23.78 v40.58,24.23 | v40.09,26.12 40.58,26.61 U3.2
N$28
  Bottom 0.305: R21.2 38.34,23.73 C18.2 38.7,23.09 38.09,23.7 38.09,25.43 38.97,26.31 C19.2 38.97,26.71 39.34,27.08 R20.1
OUT  (via drill 0.35)
  Top 0.406: v45.64,30.66 43.28,30.66 R26.2 36.14,23.51 25.87,23.51 v20.56,18.19
  Bottom 0.254: U1.15 19.77,17.4
  Bottom 0.305: 19.77,17.4 v20.56,18.19
  Bottom 0.406: JP4.1 48.98,29.38 47.71,30.66 v45.64,30.66 44.69,29.7 44.69,28.27 45.08,27.88 U3.6 U3.7
REF  (via drill 0.35)
  Top 0.406: v49.61,6.45 49.61,7.16 52.07,9.62 52.07,18.04 48.94,20.99 J1.2
  Bottom 0.406: R13.2 38.42,6.47 39.39,5.49 48.41,5.49 49.37,6.45 v49.61,6.45 49.61,4.79 JP3.1
REFOUT  (via drill 0.35)
  Top 0.406: v37.2,19.24 40.85,22.89 v42.38,22.89
  Bottom 0.254: U2.8 40.08,15.26 | 40.08,15.26 39.92,15.26 | 39.92,15.26 39.53,15.26 | 39.53,15.26 39.29,15.26 39.27,15.28 R16.2 | R16.2 38.97,14.94 | 39.48,14.62 38.97,14.11 C13.2 | 39.58,14.72 39.66,14.8 | 39.66,14.8 40.08,15.22 40.08,15.26 | 39.92,15.26 39.84,15.18 | 39.84,15.18 39.66,14.99 | 39.66,14.99 39.66,14.8 | 39.48,14.62 38.97,14.62 38.81,14.62 | 39.48,14.62 39.58,14.72 | 39.66,14.99 39.62,15.03 39.22,15.03 R16.2 | 39.58,14.72 39.53,14.72 R16.2 | 39.84,15.18 39.61,15.18 39.53,15.26
  Bottom 0.305: 51.86,16.87 C10.1 | 43.85,21.42 43.92,21.42
  Bottom 0.406: R25.1 51.59,22.4 52.86,21.13 52.86,17.88 51.86,16.87 | R16.2 38.31,15.28 37.2,16.39 v37.2,19.24 | R25.1 50.77,22.24 | R25.1 50.77,22.04 50.15,21.42 43.92,21.42 R24.2 | v42.38,22.89 43.85,21.42
  Bottom 0.813: 38.97,14.94 38.81,14.78 38.81,14.62 | 38.97,14.62 C13.2
SDN  (via drill 0.35)
  Top 0.254: 20.66,16.9 20.6,16.96 v20.52,16.96
  Top 0.305: v40.89,20.16 34.4,13.67 23.89,13.67 20.66,16.9
  Bottom 0.254: U2.13 42.86,19.07 41.77,20.16 | v20.52,16.96 20.5,16.96 19.95,16.4 U1.17
  Bottom 0.305: 41.77,20.16 v40.89,20.16
SW  (via drill 0.35)
  Top 0.406: v49.77,15.1 47.62,12.95 v40.56,12.95
  Bottom 0.254: U2.6 40.56,13.91 v40.56,12.95
  Bottom 0.305: R8.2 52.05,13.67 52.05,14.75 51.83,14.96 C10.2 51.73,15.1 v49.77,15.1
USART1_RX
  Bottom 0.254: U1.32 13.54,11.09 11.42,8.97 11.1,8.97
  Bottom 0.305: 11.1,8.97 7.85,5.72 P2.PAD_PD4
USART1_TX  (via drill 0.35)
  Top 0.305: P2.PAD_PU4 12.04,9.12 v16.29,9.12
  Bottom 0.254: U1.29 15.05,12.18 15.05,11.07 16.28,9.85 16.28,9.13 v16.29,9.12
USART2_RX
  Bottom 0.254: 19.37,18.27 19,17.9 U1.14
  Bottom 0.305: P2.PAD_PD2 19.38,26.95 19.38,20.1 19.39,20.1 19.39,18.29 19.37,18.27
USART2_TX  (via drill 0.35)
  Top 0.305: P2.PAD_PU2 22.15,29.62 20.88,28.35 v19.68,28.35
  Bottom 0.254: 18.77,19.07 18.11,18.4 U1.13
  Bottom 0.305: v19.68,28.35 19.68,28.04 18.77,27.12 18.77,19.07
USART3_RX
  Bottom 0.254: U1.23 19,13.4 22.15,10.25
  Bottom 0.305: P2.PAD_PD3 22.15,10.25
USART3_TX  (via drill 0.35)
  Top 0.305: v22.91,7.67 22.91,5.69 P2.PAD_PU3
  Bottom 0.254: U1.22 19.29,13.9 20,13.19
  Bottom 0.305: 20,13.19 22.91,10.28 v22.91,7.67
USART5_RX
  Bottom 0.254: U1.40 9.56,14.4
  Bottom 0.305: P2.PAD_PD5 1.17,16.84 7.12,16.84 9.56,14.4
USART5_TX  (via drill 0.35)
  Top 0.305: v3.41,17.72 3.01,17.32 P2.PAD_PU5
  Bottom 0.254: U1.41 9.88,14.9 9.58,15.2 9.6,15.2
  Bottom 0.305: v3.41,17.72 3.7,17.42 7.38,17.42 9.6,15.2
USART6_RX
  Bottom 0.254: U1.48 9.15,18.4 6.27,21.29
  Bottom 0.305: P2.PAD_PD1 6.27,28.13 6.27,21.29
USART6_TX  (via drill 0.35)
  Top 0.305: P2.PAD_PU1 7.85,28 v5.51,25.65
  Bottom 0.254: U1.47 8.8,17.9 5.42,21.29
  Bottom 0.305: v5.51,25.65 5.42,25.56 5.42,21.29
VDD  (via drill 0.35)  (11 unrouted)
  Bottom 0.254: U1.31 14.04,9.98 13.54,9.49 C5.1
  Bottom 0.508: 13.26,9.2 13.54,9.49 | v13.26,5.5 v13.25,5.49
  Bottom 0.61: 13.26,9.2 C7.1 v13.26,5.5
  pour Top (no thermals): -0.08,26.13 -0.08,8.75 0,8.67 14.84,0.02 30,8.51 44.92,0.02 60.01,8.59 60.01,25.89 45,34.7 30.08,26.05 15.12,34.76 0.08,26.13
VDDA  (via drill 0.35)
  Top 0.61: FB1.1 9.36,21.13 v8.25,22.24 | 22.93,11.39 22.88,11.45
  Top 0.813: v45.48,24.38 45.48,20.1 v45.41,20.03 45.41,19.07 45.91,18.58 v45.91,16.04
  Top 1.016: v50.72,9.94 v41.75,9.94 33.18,9.94 31.72,11.39 22.93,11.39 | 22.88,11.45 17.86,11.45 13.81,15.49 13.81,25.18 11.2,27.78 v11.18,27.78
  Bottom 0.254: 45.98,15.99 45.96,15.99 45.72,15.76 45.62,15.76 | U2.17 45.62,15.76 | v45.91,16.04 45.62,15.76 | 44.69,17.32 44.57,17.21 U2.15 | U2.15 | U2.15 43.87,16.94
  Bottom 0.406: U1.5 13.54,19.66 13.08,20.12 10.4,20.12 9.94,20.57 FB1.1 | 44.69,17.32 45.62,18.25 C8.1
  Bottom 0.508: C1.1 9.76,23.37 | 9.76,26.77 9.84,26.84 | U3.8 46.95,25.34 47.54,24.74
  Bottom 0.61: FB1.1 9.86,21.21 C1.1 9.28,23.27 v8.25,22.24 | 9.76,23.37 C4.1 9.76,26.77 | 9.84,26.84 11.19,26.84 | 11.19,26.84 13.41,26.84 13.89,26.37 C2.1 | v41.75,9.94 40.69,8.88 R10.2 | v50.72,9.94 47.8,9.94 R9.2 | v11.18,27.78 11.19,27.77 11.19,26.84 | v45.41,20.03 45.62,19.83 C8.1 | R4.2 46.77,16.9 v45.91,16.04 | v45.48,24.38 45.84,24.74 47.54,24.74 48.56,24.74 C15.1 50.42,24.73 C14.1
  Bottom 0.813: C14.1 51.03,24.94 53.73,22.24 53.73,13.03 50.72,10.02 v50.72,9.94
  pour Bottom (no thermals): 13.02,19.46 13.02,18.75 14.05,18.75 14.05,19.46
VSSA
  Bottom 0.254: 11.8,20.97 C3.2 | U1.7 14.52,19.12 14.52,19.66 13.21,20.97
  Bottom 0.406: 13.21,20.97 11.8,20.97
  Bottom 0.508: 11.66,23.37 C1.2 | C2.2 13.91,23.77
  Bottom 0.61: C4.2 11.66,23.75 | 11.66,23.75 11.66,23.37 | C1.2 11.56,21.21 C3.2 | C2.2 11.66,23.75 | 13.91,23.77 R2.1

### Text on the board
tPlace: 3V3 | 3V3 | R | *P2 | 3V3 | P1 | 3V3 | 3V3 | P5 | B | 3V3 | C | D | 3V3 | 3V3 | P4 | P3 | 3V3 | 3V3
bPlace: H2BR00
tNames: OUT | GND | ECG/EOG/EEG | EMG | IN+ | IN- | Ref
bNames: GND | GND | *P2 | OUT | R | GND | P1 | GND | GND | GND | P5 | B | GND | C | GND | D | IN+ | GND | IN- | P4 | P3 | Ref | GND | GND